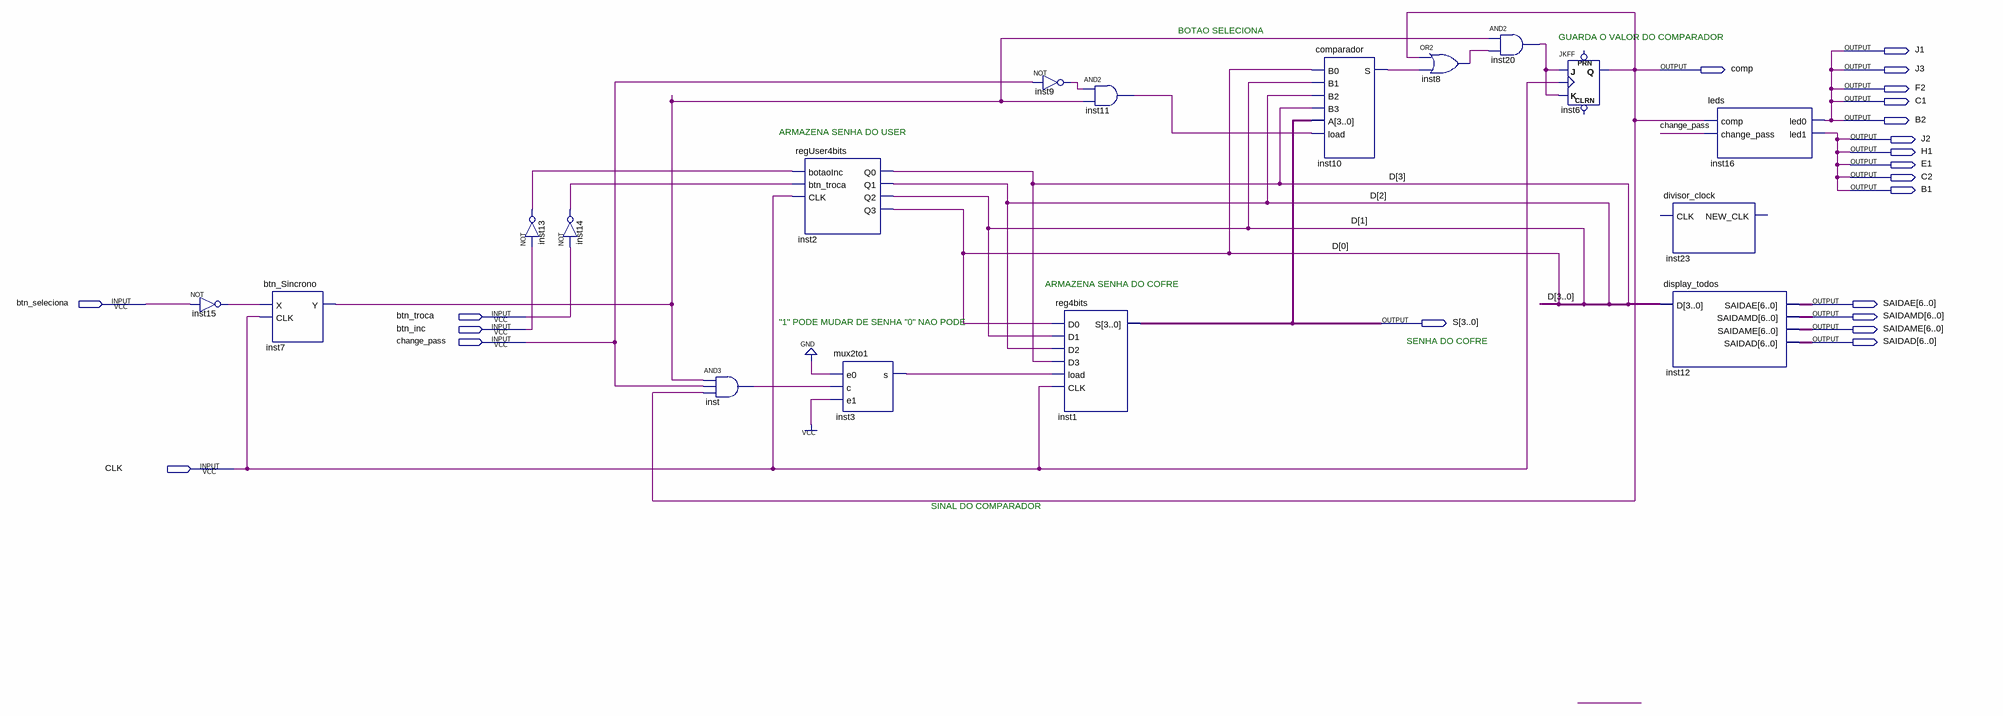
[diagram p0: schematic sheet]
// Quartus schematic reg_decod_regUser.bdf as structural Verilog: 17 symbols, 21 pins
module reg_decod_regUser (
  input  btn_seleciona,
  input  btn_troca,
  input  btn_inc,
  input  change_pass,
  input  CLK,
  output J1,
  output comp,
  output J3,
  output F2,
  output C1,
  output B2,
  output J2,
  output H1,
  output E1,
  output C2,
  output B1,
  output [6:0] SAIDAE,
  output [6:0] SAIDAMD,
  output [3:0] S,
  output [6:0] SAIDAME,
  output [6:0] SAIDAD
);

  wire inst3_s, inst7_y, inst8_out, inst9_out, inst10_s, inst11_out, inst13_out, inst14_out, inst15_out,
       inst20_out, inst_out;
  wire [3:0] D;

  not inst15 (inst15_out, btn_seleciona);
  btn_Sincrono inst7 (.X(inst15_out), .CLK(CLK), .Y(inst7_y));
  not inst13 (inst13_out, btn_inc);
  not inst14 (inst14_out, btn_troca);
  and inst (inst_out, inst7_y, change_pass, comp);
  regUser4bits inst2 (
    .botaoInc(inst13_out), .btn_troca(inst14_out), .CLK(CLK), .Q0(D[3]), .Q1(D[2]), .Q2(D[1]), .Q3(D[0]));
  mux2to1 inst3 (.e0(1'b0), .c(inst_out), .e1(1'b1), .s(inst3_s));
  not inst9 (inst9_out, change_pass);
  and inst11 (inst11_out, inst9_out, inst7_y);
  reg4bits inst1 (.D0(D[0]), .D1(D[1]), .D2(D[2]), .D3(D[3]), .load(inst3_s), .CLK(CLK), .S(S));
  comparador inst10 (.B0(D[0]), .B1(D[1]), .B2(D[2]), .B3(D[3]), .A(S), .load(inst11_out), .S(inst10_s));
  or inst8 (inst8_out, comp, inst10_s);
  and inst20 (inst20_out, inst7_y, inst8_out);
  JKFF inst6 (.K(inst20_out), .J(inst20_out), .CLK(CLK), .Q(comp));  // open: PRN, CLRN
  divisor_clock inst23 ();  // open: CLK, NEW_CLK
  display_todos inst12 (.D(D), .SAIDAE(SAIDAE), .SAIDAMD(SAIDAMD), .SAIDAME(SAIDAME), .SAIDAD(SAIDAD));
  leds inst16 (.comp(comp), .change_pass(change_pass), .led0(B2), .led1(B1));

  assign C1 = B2;
  assign C2 = B1;
  assign E1 = B1;
  assign F2 = B2;
  assign H1 = B1;
  assign J1 = B2;
  assign J2 = B1;
  assign J3 = B2;

  // Notes on the sheet:
  //   BOTAO SELECIONA
  //   GUARDA O VALOR DO COMPARADOR
  //   ARMAZENA SENHA DO USER
  //   ARMAZENA SENHA DO COFRE
  //   "1" PODE MUDAR DE SENHA "0" NAO PODE
  //   SENHA DO COFRE
  //   SINAL DO COMPARADOR
endmodule
